# Altium schematic sheet Sensors.SchDoc: Sensors / Peripherals
size A4; Author: Lázár Sándor; SheetNumber: 4; SheetTotal: 6; URL: lzrsystems.com
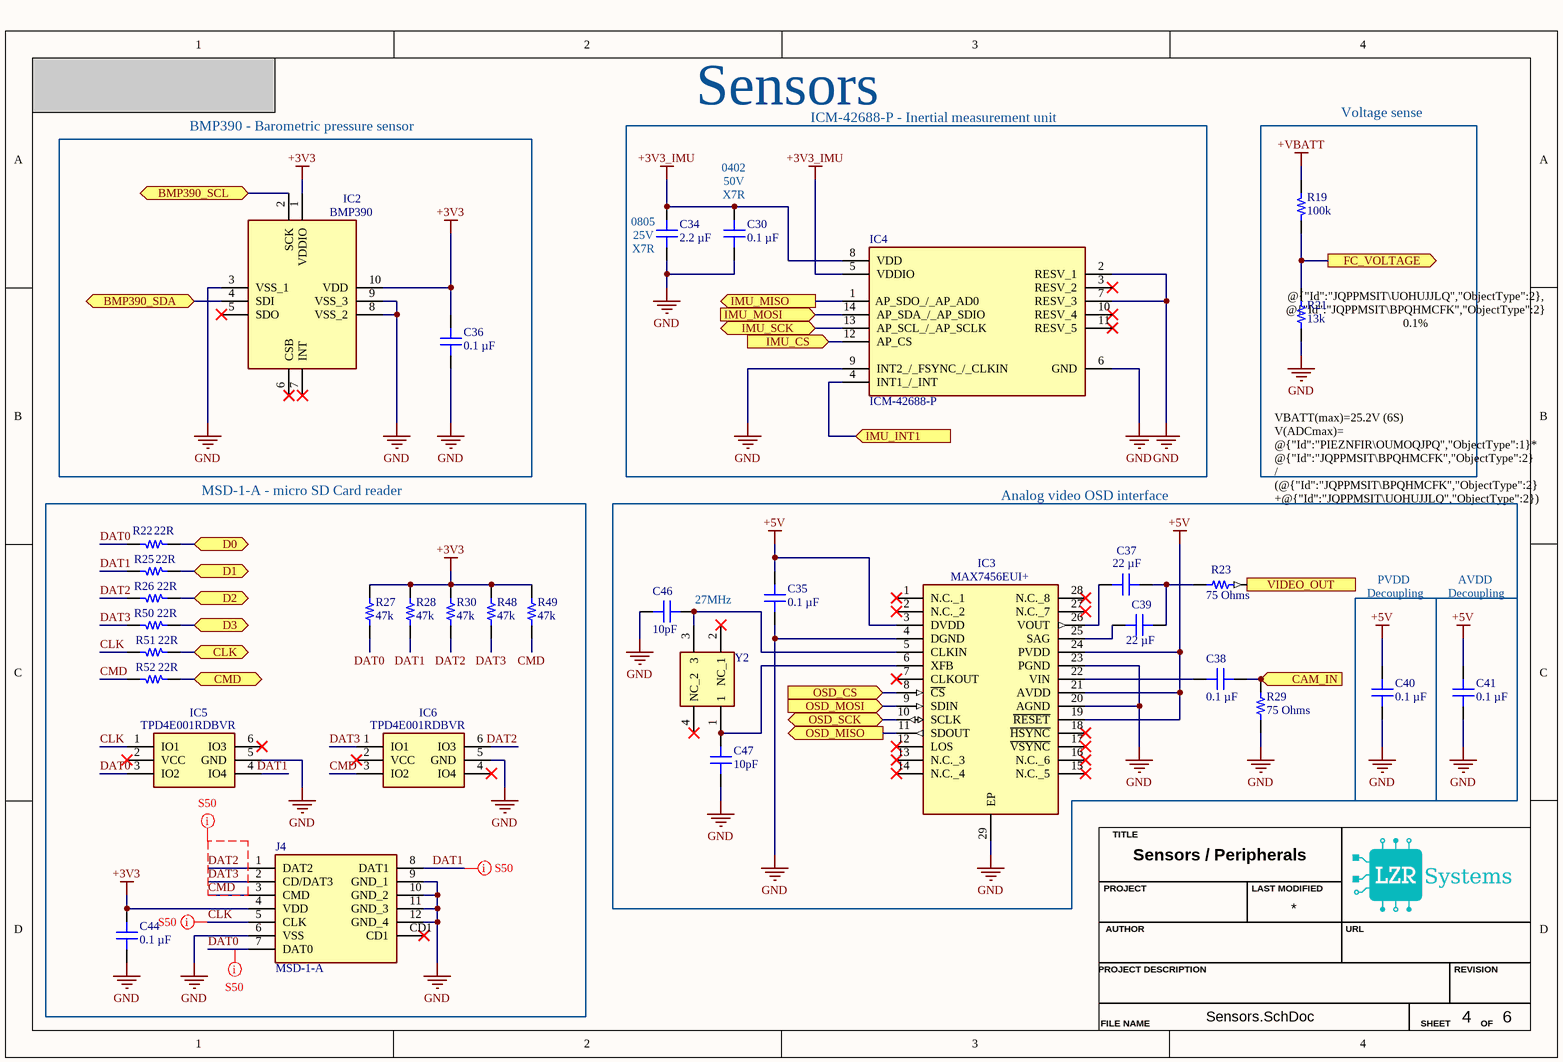
[diagram p0: Sensors.SchDoc]

## Parts
C30  0.1 µF  [MURATA GCM155 0402_1005]
C34  2.2 µF  [CAP 0805_2012]
C35  0.1 µF  [MURATA GCM155 0402_1005]
C36  0.1 µF  [MURATA GCM155 0402_1005]
C37  22 µF  [MURATA GRM21B 0805_2012]
C38  0.1 µF  [MURATA GCM155 0402_1005]
C39  22 µF  [MURATA GRM21B 0805_2012]
C40  0.1 µF  [MURATA GCM155 0402_1005]
C41  0.1 µF  [MURATA GCM155 0402_1005]
C44  0.1 µF  [MURATA GCM155 0402_1005]
C46  Capacitance: 10pF  [CAP 0402_1005]  (hidden comment: 10 pF)
C47  Capacitance: 10pF  [CAP 0402_1005]  (hidden comment: 10 pF)
IC2  BMP390  [BMP390]
IC3  MAX7456EUI+  [SOP65P638X110-29N]
IC4  ICM-42688-P  [IIM42352]
IC5  TPD4E001RDBVR  [SOT95P280X145-6N]
IC6  TPD4E001RDBVR  [SOT95P280X145-6N]
J4  MSD-1-A  [MSD1A]
R19  100k  [YAGEO RES 0402_1005]
R21  13k  [YAGEO RES 0402_1005]
R22  22R  [YAGEO RES 0402_1005]
R23  75 Ohms  [RES 0805_2012]
R25  22R  [YAGEO RES 0402_1005]
R26  22R  [YAGEO RES 0402_1005]
R27  47k  [YAGEO RES 0402_1005]
R28  47k  [YAGEO RES 0402_1005]
R29  75 Ohms  [RES 0805_2012]
R30  47k  [YAGEO RES 0402_1005]
R48  47k  [YAGEO RES 0402_1005]
R49  47k  [YAGEO RES 0402_1005]
R50  22R  [YAGEO RES 0402_1005]
R51  22R  [YAGEO RES 0402_1005]
R52  22R  [YAGEO RES 0402_1005]
Y2  XRCGB27M000FAN00R0  [XRCGB]  (value not drawn)

## Blocks framed on the sheet
BMP390 - Barometric pressure sensor: C36 IC2
ICM-42688-P - Inertial measurement unit: C30 C34 IC4
Voltage sense: R19 R21
MSD-1-A - micro SD Card reader: C44 IC5 IC6 J4 R22 R25-R28 R30 R48-R52
Analog video OSD interface: C35 C37-C41 C46 C47 IC3 R23 R29 Y2

## Ports
BMP390_SCL (bidir), BMP390_SDA (bidir), CAM_IN (in), CLK (bidir), CMD (bidir), D0 (bidir), D1 (bidir), D2 (bidir), D3 (bidir), FC_VOLTAGE (out), IMU_CS (in), IMU_INT1 (in), IMU_MISO (out), IMU_MOSI (in), IMU_SCK (bidir), OSD_CS (in), OSD_MISO (out), OSD_MOSI (in), OSD_SCK (bidir), VIDEO_OUT (out)

## Nets
+3V3: C36.2 C44.2 IC2.1(VDDIO) IC2.10(VDD) J4.4(VDD) R27.2 R28.2 R30.2 R48.2 R49.2
+3V3_IMU: C30.2 C34.2 IC4.5(VDDIO) IC4.8(VDD)
+5V: C35.2 C40.2 C41.2 IC3.3(DVDD) IC3.19(~{RESET}) IC3.21(AVDD) IC3.24(PVDD)
+VBATT: R19.2
GND: C30.1 C34.1 C35.1 C36.1 C40.1 C41.1 C44.1 C46.2 C47.2 IC2.3(VSS_1) IC2.8(VSS_2) IC2.9(VSS_3) IC3.4(DGND) IC3.20(AGND) IC3.23(PGND) IC3.29(EP) IC4.2(RESV_1) IC4.6(GND) IC4.7(RESV_3) IC4.9(INT2_/_FSYNC_/_CLKIN) IC5.5(GND) IC6.5(GND) J4.6(VSS) J4.9(GND_1) J4.10(GND_2) J4.11(GND_3) J4.12(GND_4) R21.1 R29.1
BMP390_SCL: IC2.2(SCK) ; port BMP390_SCL
BMP390_SDA: IC2.4(SDI) ; port BMP390_SDA
CAM_IN: C38.1 R29.2 ; port CAM_IN
CLK: IC5.1(IO1) J4.5(CLK) R51.1
CLK: R51.2 ; port CLK  [a separate net that carries the same name]
CMD: IC6.3(IO2) J4.3(CMD) R49.1 R52.1
CMD: R52.2 ; port CMD  [a separate net that carries the same name]
D0: R22.2 ; port D0
D1: R25.2 ; port D1
D2: R26.2 ; port D2
D3: R50.2 ; port D3
DAT0: IC5.3(IO2) J4.7(DAT0) R22.1 R27.1
DAT1: IC5.4(IO4) J4.8(DAT1) R25.1 R28.1
DAT2: IC6.6(IO3) J4.1(DAT2) R26.1 R30.1
DAT3: IC6.1(IO1) J4.2(CD/DAT3) R48.1 R50.1
FC_VOLTAGE: R19.1 R21.2 ; port FC_VOLTAGE
IMU_CS: IC4.12(AP_CS) ; port IMU_CS
IMU_INT1: IC4.4(INT1_/_INT) ; port IMU_INT1
IMU_MISO: IC4.1(AP_SDO_/_AP_AD0) ; port IMU_MISO
IMU_MOSI: IC4.14(AP_SDA_/_AP_SDIO) ; port IMU_MOSI
IMU_SCK: IC4.13(AP_SCL_/_AP_SCLK) ; port IMU_SCK
OSD_CS: IC3.8(~{CS}) ; port OSD_CS
OSD_MISO: IC3.11(SDOUT) ; port OSD_MISO
OSD_MOSI: IC3.9(SDIN) ; port OSD_MOSI
OSD_SCK: IC3.10(SCLK) ; port OSD_SCK
VIDEO_OUT: R23.2 ; port VIDEO_OUT
NetC37_1: C37.1 C39.1 R23.1
NetC37_2: C37.2 IC3.26(VOUT)
NetC38_2: C38.2 IC3.22(VIN)
NetC39_2: C39.2 IC3.25(SAG)
NetC46_1: C46.1 IC3.5(CLKIN) Y2.3
NetC47_1: C47.1 IC3.6(XFB) Y2.1

Not connected (* = marked no-connect by the designer): IC2 5(SDO)* 6(CSB)* 7(INT)*; IC3 1(N.C._1)* 2(N.C._2)* 7(CLKOUT)* 12(LOS)* 13(N.C._3)* 14(N.C._4)* 15(N.C._5)* 16(N.C._6)* 17(~{VSYNC})* 18(~{HSYNC})* 27(N.C._7)* 28(N.C._8)*; IC4 3(RESV_2)* 10(RESV_4)* 11(RESV_5)*; IC5 2(VCC)* 6(IO3)*; IC6 2(VCC)* 4(IO4)*; J4 CD1*; Y2 2(NC_1)* 4(NC_2)*

## Layout directives
net class S50: CLK, CMD, DAT0, DAT1, DAT2, DAT3

## Notes on the sheet
- Sensors
- (near C30) 0402
  50V
  X7R
- (near C34) 0805
  25V
  X7R
- @{"Id":"JQPPMSIT\UOHUJJLQ","ObjectType":2}, @{"Id":"JQPPMSIT\BPQHMCFK","ObjectType":2}
  0.1%
  25ppm
- VBATT(max)=25.2V (6S)
  V(ADCmax)=
  @{"Id":"PIEZNFIR\OUMOQJPQ","ObjectType":1}* @{"Id":"JQPPMSIT\BPQHMCFK","ObjectType":2} / (@{"Id":"JQPPMSIT\BPQHMCFK","ObjectType":2} +@{"Id":"JQPPMSIT\UOHUJJLQ","ObjectType":2}) =
  2.9V
- (near C46) 27MHz
- PVDD
  Decoupling
- AVDD
  Decoupling
- TITLE
- AUTHOR
- PROJECT
- LAST MODIFIED
- URL
- PROJECT DESCRIPTION
- REVISION
- FILE NAME
- SHEET
- OF

## Library data of the parts
C30 C35 C36 C38 C40 C41 C44 = GCM155R71H104ME02D: CAP CER 0.1UF 50V X7R 0402; manufacturer: Murata Electronics; Tolerance: ±20%; Part Number: GCM155R71H104ME02D; Capacitance: 0.1 µF; Applications: Automotive; componentlink1description: Datasheet; componentlink1url: https://psearch.en.murata.com/capacitor/product/GCM155R71H104ME02%23.pdf; componentlink2description: DigiKey Link; componentlink2url: https://www.digikey.com/en/products/detail/murata-electronics/GCM155R71H104ME02D/9867913; Device Package: 0402 (1005 Metric); lastupdated: 7/20/2024 2:04:19 AM; Lifecycle Status: Active; Minimum Order: 1; Mounting Type: Surface Mount, MLCC; Operating Temperature: -55°C ~ 125°C; Package / Case: 0402 (1005 Metric); packaging: TapeAndReel; partid: 39038; Part Status: Active; price: 0.01; Ratings: AEC-Q200; series: GCM; Size / Dimension: 0.039" L x 0.020" W (1.00mm x 0.50mm); Supplier 1: DigiKey; Supplier Part Number 1: 490-18204-1-ND; Temperature Coefficient: X7R; Thickness (Max): 0.022" (0.55mm); value: 0.1 µF; Voltage - Rated: 50V
C34 = GCJ21BR71E225KA01K: CAP CER; manufacturer: Murata Electronics; Temperature Coefficient: X7R; Tolerance: ±10%; Voltage - Rated: 25V; Part Number: GCJ21BR71E225KA01K; Capacitance: 2.2 µF; Applications: Automotive, Boardflex Sensitive; componentlink2description: DigiKey Link; componentlink2url: https://www.digikey.com/en/products/detail/murata-electronics/GCJ21BR71E225KA01K/10692344; Device Package: 0805 (2012 Metric); Features: Soft Termination; lastupdated: 2/9/2024 8:15:05 PM; Lifecycle Status: Active; Minimum Order: 1; Mounting Type: Surface Mount, MLCC; Operating Temperature: -55°C ~ 125°C; Package / Case: 0805 (2012 Metric); packaging: TapeAndReel; partid: 46223; Part Status: Active; price: 0.06; Ratings: AEC-Q200; series: GCJ; Size / Dimension: 0.079" L x 0.049" W (2.00mm x 1.25mm); Supplier 1: DigiKey; Supplier Part Number 1: 490-GCJ21BR71E225KA01KCT-ND; Thickness (Max): 0.057" (1.45mm); value: 2.2 µF
C37 C39 = GRM21BR61C226ME44L: CAP CER 22UF 16V X5R 0805; manufacturer: Murata Electronics; Tolerance: ±20%; Part Number: GRM21BR61C226ME44L; Capacitance: 22 µF; Applications: General Purpose; componentlink1description: Datasheet; componentlink1url: https://search.murata.co.jp/Ceramy/image/img/A01X/G101/ENG/GRM21BR61C226ME44-01.pdf; componentlink2description: DigiKey Link; componentlink2url: https://www.digikey.com/en/products/detail/murata-electronics/GRM21BR61C226ME44L/4905531; Device Package: 0805 (2012 Metric); lastupdated: 8/27/2024 9:29:55 AM; Lifecycle Status: Active; Minimum Order: 1; Mounting Type: Surface Mount, MLCC; Operating Temperature: -55°C ~ 85°C; Package / Case: 0805 (2012 Metric); packaging: TapeAndReel; partid: 16967; Part Status: Active; price: 0.06; series: GRM; Size / Dimension: 0.079" L x 0.049" W (2.00mm x 1.25mm); Supplier 1: DigiKey; Supplier Part Number 1: 490-10747-1-ND; Temperature Coefficient: X5R; Thickness (Max): 0.057" (1.45mm); value: 22 µF; Voltage - Rated: 16V
C46 C47 = C0402C100K4GAC7867: CAP CER 10PF 16V C0G/NP0 0402; manufacturer: KEMET; Temperature Coefficient: C0G, NP0; Tolerance: ±10%; Part Number: C0402C100K4GAC7867; Applications: General Purpose; componentlink1description: Datasheet; componentlink1url: https://api.kemet.com/component-edge/download/datasheet/C0402C100K4GACTU.pdf; componentlink2description: DigiKey Link; componentlink2url: https://www.digikey.com/en/products/detail/kemet/C0402C100K4GAC7867/2196156; Device Package: 0402 (1005 Metric); Features: Low ESL; lastupdated: 2/9/2024 8:04:15 PM; Lifecycle Status: Active; Minimum Order: 1; Mounting Type: Surface Mount, MLCC; Operating Temperature: -55°C ~ 125°C; Package / Case: 0402 (1005 Metric); packaging: TapeAndReel; partid: 33741; Part Status: Active; price: 0.05; series: SMD Comm C0G; Size / Dimension: 0.039" L x 0.020" W (1.00mm x 0.50mm); Supplier 1: DigiKey; Supplier Part Number 1: 399-C0402C100K4GAC7867CT-ND; Thickness (Max): 0.022" (0.55mm); value: 10 pF; Voltage - Rated: 16V
IC2 = BMP390: Integrated Circuit; Manufacturer_Name: BOSCH; Datasheet Link: https://www.bosch-sensortec.com/media/boschsensortec/downloads/datasheets/bst-bmp390-ds002.pdf; Height: 0.8mm; Manufacturer_Part_Number: BMP390; Mouser Part Number: 262-BMP390; Mouser Price/Stock: https://www.mouser.co.uk/ProductDetail/Bosch-Sensortec/BMP390?qs=QNEnbhJQKvYQVfvRMgo2YA%3D%3D; Arrow Part Number: BMP390; Arrow Price/Stock: https://www.arrow.com/en/products/bmp390/bosch-sensortec?utm_currency=USD&region=nac
IC3 = MAX7456EUI+: Integrated Circuit; Manufacturer_Name: Analog Devices; Datasheet Link: http://uk.rs-online.com/web/p/products/7326970; Height: 1.1mm; Manufacturer_Part_Number: MAX7456EUI+; Mouser Part Number: 700-MAX7456EUI; Mouser Price/Stock: https://www.mouser.co.uk/ProductDetail/Analog-Devices-Maxim-Integrated/MAX7456EUI%2b?qs=1THa7WoU59EGj4X9409NRQ%3D%3D
IC4 = ICM-42688-P: Integrated Circuit; Manufacturer_Name: TDK; Datasheet Link: https://3cfeqx1hf82y3xcoull08ihx-wpengine.netdna-ssl.com/wp-content/uploads/2021/06/DS-000347-ICM-42688-P-v1.5.pdf; Manufacturer_Part_Number: ICM-42688-P; Mouser Part Number: 410-ICM-42688-P; Mouser Price/Stock: https://www.mouser.co.uk/ProductDetail/TDK-InvenSense/ICM-42688-P?qs=OlC7AqGiEDk8QrNAV728zw%3D%3D; Arrow Part Number: ICM-42688-P; Arrow Price/Stock: https://www.arrow.com/en/products/icm-42688-p/invensense?utm_currency=USD&region=nac
IC5 IC6 = TPD4E001RDBVR: Integrated Circuit; Manufacturer_Name: Texas Instruments; Datasheet Link: http://www.ti.com/lit/gpn/TPD4E001; Height: 1.45mm; Manufacturer_Part_Number: TPD4E001RDBVR; Mouser Part Number: 595-TPD4E001RDBVR; Mouser Price/Stock: https://www.mouser.co.uk/ProductDetail/Texas-Instruments/TPD4E001RDBVR?qs=P1JMDcb91o7xMbcYcXI1uw%3D%3D; Arrow Part Number: TPD4E001RDBVR; Arrow Price/Stock: https://www.arrow.com/en/products/tpd4e001rdbvr/texas-instruments?utm_currency=USD&region=nac
J4 = MSD-1-A: Connector; Manufacturer_Name: Same Sky; Datasheet Link: https://www.sameskydevices.com/product/resource/msd-1-a.pdf; Height: 2mm; Manufacturer_Part_Number: MSD-1-A; Mouser Part Number: 179-MSD-1-A; Mouser Price/Stock: https://www.mouser.co.uk/ProductDetail/Same-Sky/MSD-1-A?qs=Z%252BL2brAPG1Ip18XLC4tUPQ%3D%3D; Arrow Part Number: MSD-1-A; Arrow Price/Stock: https://www.arrow.com/en/products/msd-1-a/cui-devices?utm_currency=USD&region=nac
R19 = AA0402FR-07100KL: RES SMD 100K OHM 1% 1/16W 0402; Manufacturer: Yageo; Power (Watts): 0.063W, 1/16W; Resistance: 100 kOhms; Temperature Coefficient: ±150ppm/°C; Part Number: AA0402FR-07100KL; Value: 100k; ComponentLink1Description: Datasheet; ComponentLink1URL: https://www.yageo.com/upload/media/product/productsearch/datasheet/rchip/PYu-AA_51_RoHS_L_3.pdf; ComponentLink2Description: DigiKey Link; ComponentLink2URL: https://www.digikey.com/en/products/detail/yageo/AA0402FR-07100KL/5887718; Composition: Thick Film; Device Package: 0402 (1005 Metric); Features: Anti-Sulfur, Automotive AEC-Q200, Moisture Resistant; Height - Seated (Max): 0.015" (0.37mm); LastUpdated: 8/31/2025 3:03:39 PM; Lifecycle Status: Active; Minimum Order: 1; Number of Terminations: 2; Operating Temperature: -55°C ~ 155°C; Package / Case: 0402 (1005 Metric); Packaging: CutTape; PartId: 78675; Price: 0.01; Ratings: AEC-Q200; Series: AA; Size / Dimension: 0.039" L x 0.020" W (1.00mm x 0.50mm); Supplier 1: DigiKey; Supplier Part Number 1: 13-AA0402FR-07100KLCT-ND; Supplier Device Package: 0402; Tolerance: ±1%
R21 = AC0402FR-0713KL: RES SMD 13K OHM 1% 1/16W 0402; Manufacturer: Yageo; Power (Watts): 0.063W, 1/16W; Resistance: 13 kOhms; Temperature Coefficient: ±100ppm/°C; Part Number: AC0402FR-0713KL; Value: 13k; ComponentLink1Description: Datasheet; ComponentLink1URL: https://www.yageo.com/upload/media/product/productsearch/datasheet/rchip/PYu-AC_51_RoHS_L_8.pdf; ComponentLink2Description: DigiKey Link; ComponentLink2URL: https://www.digikey.com/en/products/detail/yageo/AC0402FR-0713KL/5895068; Composition: Thick Film; Device Package: 0402 (1005 Metric); Features: Automotive AEC-Q200, Moisture Resistant; Height - Seated (Max): 0.015" (0.37mm); LastUpdated: 8/31/2025 3:03:55 PM; Lifecycle Status: Active; Minimum Order: 1; Number of Terminations: 2; Operating Temperature: -55°C ~ 155°C; Package / Case: 0402 (1005 Metric); Packaging: CutTape; PartId: 60414; Part Status: Active; Price: 0.01; Ratings: AEC-Q200; Series: AC; Size / Dimension: 0.039" L x 0.020" W (1.00mm x 0.50mm); Supplier 1: DigiKey; Supplier Part Number 1: 13-AC0402FR-0713KLCT-ND; Supplier Device Package: 0402; Tolerance: ±1%
R22 R25 R26 R50-R52 = AC0402FR-7W22RL: RES 22 OHM 1% 1/8W 0402; Manufacturer: Yageo; Power (Watts): 0.125W, 1/8W; Resistance: 22 Ohms; Temperature Coefficient: ±100ppm/°C; Part Number: AC0402FR-7W22RL; Value: 22R; ComponentLink1Description: Datasheet; ComponentLink1URL: https://www.yageo.com/upload/media/product/productsearch/datasheet/rchip/PYu-AC_51_RoHS_L_10.pdf; ComponentLink2Description: DigiKey Link; ComponentLink2URL: https://www.digikey.com/en/products/detail/yageo/AC0402FR-7W22RL/16992800; Composition: Thick Film; Device Package: 0402 (1005 Metric); Features: Automotive AEC-Q200, Moisture Resistant; Height - Seated (Max): 0.015" (0.37mm); LastUpdated: 8/31/2025 3:03:07 PM; Lifecycle Status: Active; Minimum Order: 1; Number of Terminations: 2; Operating Temperature: -55°C ~ 155°C; Package / Case: 0402 (1005 Metric); Packaging: CutTape; PartId: 90583; Price: 0.01; Ratings: AEC-Q200; Series: AC; Size / Dimension: 0.039" L x 0.020" W (1.00mm x 0.50mm); Supplier 1: DigiKey; Supplier Part Number 1: 13-AC0402FR-7W22RLCT-ND; Supplier Device Package: 0402; Tolerance: ±1%
R23 R29 = CRG0805F75R: RES SMD 75 OHM 1% 1/8W 0805; Manufacturer: TE Connectivity Passive Product; Power (Watts): 0.125W, 1/8W; Temperature Coefficient: ±200ppm/°C; Part Number: CRG0805F75R; Value: 75 Ohms; ComponentLink1Description: Datasheet; ComponentLink1URL: https://www.te.com/commerce/DocumentDelivery/DDEController?Action=srchrtrv&DocNm=1773204&DocType=DS&DocLang=English; ComponentLink2Description: DigiKey Link; ComponentLink2URL: https://www.digikey.com/en/products/detail/te-connectivity-passive-product/CRG0805F75R/2135489; Composition: Thick Film; Device Package: 0805 (2012 Metric); Height - Seated (Max): 0.026" (0.65mm); LastUpdated: 2/8/2024 9:02:08 PM; Lifecycle Status: Active; Minimum Order: 1; Number of Terminations: 2; Operating Temperature: -55°C ~ 155°C; Package / Case: 0805 (2012 Metric); Packaging: TapeAndReel; PartId: 34689; Part Status: Active; Price: 0.01; Resistance: 75 Ohms; Series: CRG, Neohm; Size / Dimension: 0.079" L x 0.049" W (2.00mm x 1.25mm); Supplier 1: DigiKey; Supplier Part Number 1: A126386CT-ND; Supplier Device Package: 0805; Tolerance: ±1%
R27 R28 R30 R48 R49 = AC0402FR-7W47KL: RES 47K OHM 1% 1/8W 0402; Manufacturer: Yageo; Power (Watts): 0.125W, 1/8W; Resistance: 47 kOhms; Temperature Coefficient: ±100ppm/°C; Part Number: AC0402FR-7W47KL; Value: 47k; ComponentLink1Description: Datasheet; ComponentLink1URL: https://www.yageo.com/upload/media/product/productsearch/datasheet/rchip/PYu-AC_51_RoHS_L_10.pdf; ComponentLink2Description: DigiKey Link; ComponentLink2URL: https://www.digikey.com/en/products/detail/yageo/AC0402FR-7W47KL/17009967; Composition: Thick Film; Device Package: 0402 (1005 Metric); Features: Automotive AEC-Q200, Moisture Resistant; Height - Seated (Max): 0.015" (0.37mm); LastUpdated: 8/31/2025 3:03:35 PM; Lifecycle Status: Active; Minimum Order: 1; Number of Terminations: 2; Operating Temperature: -55°C ~ 155°C; Package / Case: 0402 (1005 Metric); Packaging: CutTape; PartId: 86207; Price: 0.01; Ratings: AEC-Q200; Series: AC; Size / Dimension: 0.039" L x 0.020" W (1.00mm x 0.50mm); Supplier 1: DigiKey; Supplier Part Number 1: 13-AC0402FR-7W47KLCT-ND; Supplier Device Package: 0402; Tolerance: ±1%
Y2 = XRCGB48M000F4M00R0: Crystal or Oscillator; Manufacturer_Name: Murata Electronics; Datasheet Link: https://www.murata.com/products/productdata/8801067466782/SPEC-XRCGB48M000F4M00R0.pdf; Height: 0.7mm; Manufacturer_Part_Number: XRCGB48M000F4M00R0; Mouser Part Number: 81-XRCGB48M000F4M0R0; Mouser Price/Stock: https://www.mouser.co.uk/ProductDetail/Murata-Electronics/XRCGB48M000F4M00R0?qs=e%252BE4OD6MgMd07skQ7eZ%2F7Q%3D%3D; Arrow Part Number: XRCGB48M000F4M00R0; Arrow Price/Stock: https://www.arrow.com/en/products/xrcgb48m000f4m00r0/murata-manufacturing